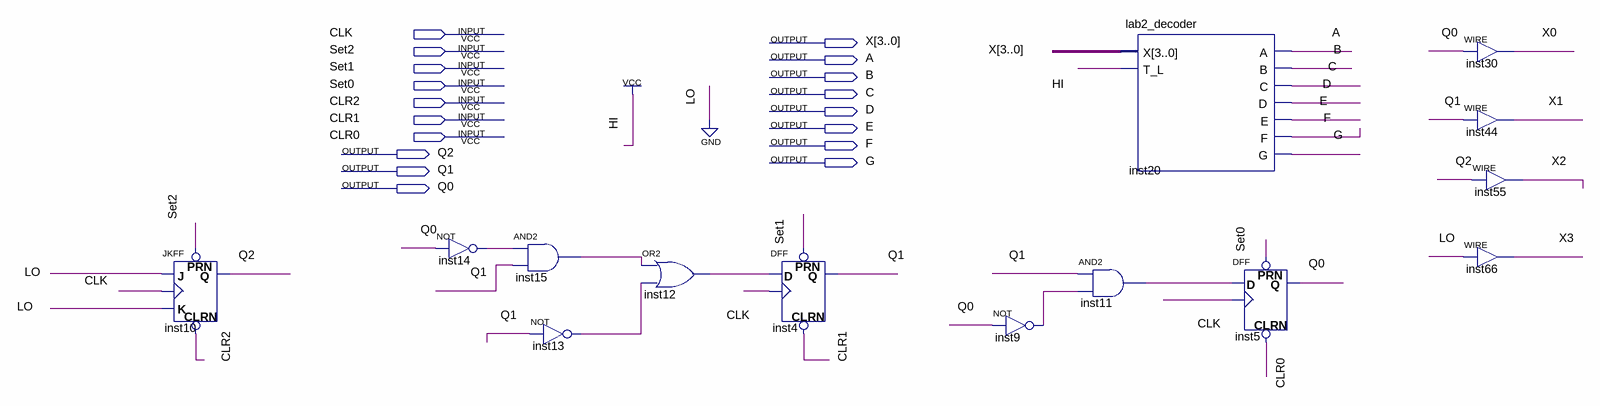
[diagram p0: schematic sheet]
// Quartus schematic Quiz3.bdf as structural Verilog: 14 symbols, 18 pins
module Quiz3 (
  input  CLK,
  input  Set2,
  input  Set1,
  input  Set0,
  input  CLR2,
  input  CLR1,
  input  CLR0,
  output [3:0] X,
  output A,
  output B,
  output C,
  output D,
  output E,
  output F,
  output Q2,
  output G,
  output Q1,
  output Q0
);

  wire inst9_out, inst11_out, inst12_out, inst13_out, inst14_out, inst15_out;

  JKFF inst10 (.PRN(Set2), .CLRN(CLR2), .K(1'b0), .J(1'b0), .CLK(CLK), .Q(Q2));
  not inst14 (inst14_out, Q0);
  and inst15 (inst15_out, inst14_out, Q1);
  not inst13 (inst13_out, Q1);
  or inst12 (inst12_out, inst15_out, inst13_out);
  DFF inst4 (.CLRN(CLR1), .CLK(CLK), .D(inst12_out), .PRN(Set1), .Q(Q1));
  not inst9 (inst9_out, Q0);
  lab2_decoder inst20 (.X(X), .T_L(1'b1), .A(A), .B(B), .C(C), .D(D), .E(E), .F(F), .G(G));
  and inst11 (inst11_out, Q1, inst9_out);
  DFF inst5 (.CLRN(CLR0), .CLK(CLK), .D(inst11_out), .PRN(Set0), .Q(Q0));
  assign X[0] = Q0;  // WIRE inst30
  assign X[1] = Q1;  // WIRE inst44
  assign X[3] = 1'b0;  // WIRE inst66
  assign X[2] = Q2;  // WIRE inst55
endmodule
